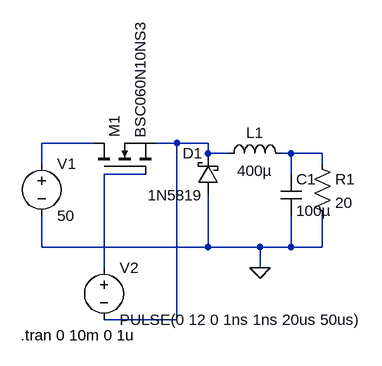
[diagram p0: schematic buck converter ltspice.asc]
buck converter ltspice.asc, the LTspice schematic file:
Version 4.1
SHEET 1 880 680
WIRE 96 80 16 80
WIRE 224 80 192 80
WIRE 272 80 224 80
WIRE 272 96 272 80
WIRE 304 96 272 96
WIRE 400 96 384 96
WIRE 448 96 400 96
WIRE 16 112 16 80
WIRE 448 112 448 96
WIRE 176 128 112 128
WIRE 400 128 400 96
WIRE 16 240 16 192
WIRE 272 240 272 160
WIRE 272 240 16 240
WIRE 352 240 272 240
WIRE 400 240 400 192
WIRE 400 240 352 240
WIRE 448 240 448 192
WIRE 448 240 400 240
WIRE 112 272 112 128
WIRE 352 272 352 240
WIRE 224 352 224 80
WIRE 224 352 112 352
FLAG 352 272 0
SYMBOL voltage 16 96 R0
WINDOW 123 0 0 Left 0
WINDOW 39 0 0 Left 0
SYMATTR InstName V1
SYMATTR Value 50
SYMBOL schottky 288 160 R180
WINDOW 0 24 64 Left 2
WINDOW 3 24 0 Left 2
SYMATTR InstName D1
SYMATTR Value 1N5819
SYMATTR Description Diode
SYMATTR Type diode
SYMBOL res 432 96 R0
SYMATTR InstName R1
SYMATTR Value 20
SYMBOL ind 288 112 R270
WINDOW 0 32 56 VTop 2
WINDOW 3 5 56 VBottom 2
SYMATTR InstName L1
SYMATTR Value 400µ
SYMATTR SpiceLine Rser=1m
SYMBOL cap 384 128 R0
SYMATTR InstName C1
SYMATTR Value 100µ
SYMBOL nmos 96 128 R270
SYMATTR InstName M1
SYMATTR Value BSC060N10NS3
SYMBOL voltage 112 256 R0
WINDOW 123 0 0 Left 0
WINDOW 39 0 0 Left 0
SYMATTR InstName V2
SYMATTR Value PULSE(0 12 0 1ns 1ns 20us 50us)
TEXT -16 376 Left 2 !.tran 0 10m 0 1u

The netlist it stands for:
* buck converter ltspice.asc
V1 N001 0 50
D1 0 N002 1N5819
R1 N003 0 20
L1 N002 N003 400µ Rser=1m
C1 N003 0 100µ
M1 N001 N004 N002 N002 BSC060N10NS3
V2 N004 N002 PULSE(0 12 0 1ns 1ns 20us 50us)
.model D D
.lib standard.dio
.model NMOS NMOS
.model PMOS PMOS
.lib standard.mos
.tran 0 10m 0 1u
.backanno
.end